# EAGLE design psRevB (EAGLE 7.4.0)
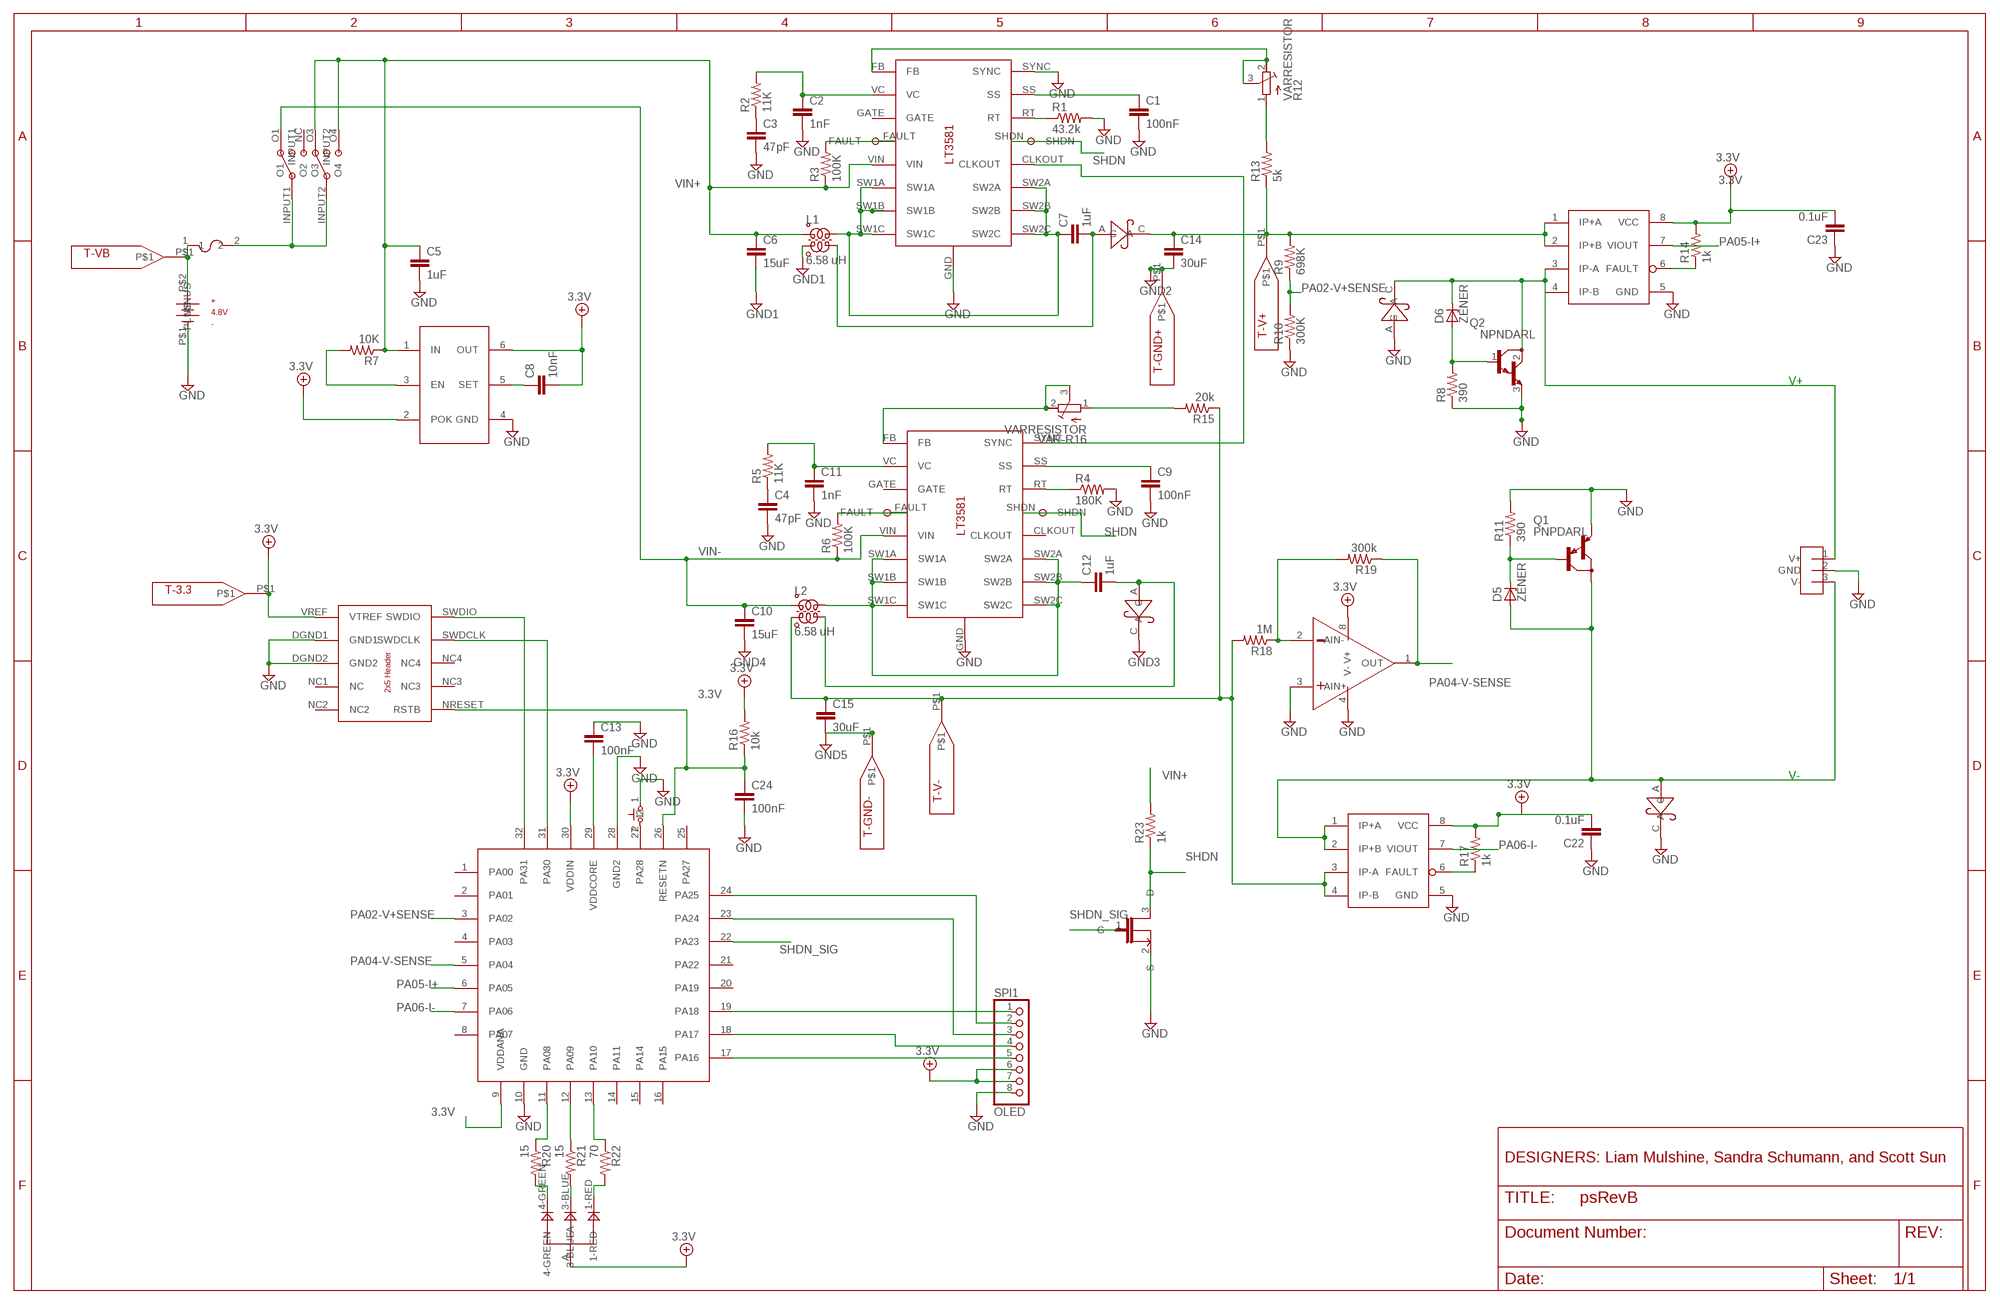
[diagram p0: schematic, sheet 1]

## Parts
BT1  BATTERY  [POWERHEAD]
C1  100nF  C-EUC0603K  [C0603K]
C2  1nF  C-EUC0603K  [C0603K]
C3  47pF  C-EUC0603K  [C0603K]
C4  47pF  C-EUC0805  [C0805]
C5  1uF  C-EUC0805  [C0805]
C6  15uF  C-EUC0805  [C0805]
C7  1uF  C-EUC0805  [C0805]
C8  10nF  C-EUC0805  [C0805]
C9  100nF  C-EUC0805  [C0805]
C10  15uF  C-EUC0805  [C0805]
C11  1nF  C-EUC0805  [C0805]
C12  1uF  C-EUC0805  [C0805]
C13  100nF  C-EUC0805  [C0805]
C14  30uF  C-EUC1206K  [C1206K]
C15  30uF  C-EUC1206K  [C1206K]
C22  0.1uF  C-EUC0805  [C0805]
C23  0.1uF  C-EUC0805  [C0805]
C24  100nF  C-EUC0805  [C0805]
D1  SCHTKYDIODE  [SCHTKYDIODE]
D2  SCHTKYDIODE  [SCHTKYDIODE]
D3  SCHTKYDIODE  [SCHTKYDIODE]
D4  SCHTKYDIODE  [SCHTKYDIODE]
D5  ZENER  [ZENER]
D6  ZENER  [ZENER]
DBG1  DEBUGHEAD  [DEBUGHEAD]
F1  FUSE  [FUSE]
L1  6.58 uH  ZD60820510  [COUPLED_INDUCTOR@1]
L2  6.58 uH  COUPLED_INDUCTOR  [COUPLED_INDUCTOR]
Q1  PNPDARL  [DPAKTO252]
Q2  NPNDARL  [DPAKTO252]
R1  43.2k  R-US_R0603  [R0603]
R2  11K  R-US_R0603  [R0603]
R3  100K  R-US_R0603  [R0603]
R4  180K  R-US_R0603  [R0603]
R5  11K  R-US_R0603  [R0603]
R6  100K  R-US_R0603  [R0603]
R7  10K  R-US_R0603  [R0603]
R8  390  R-US_R0603  [R0603]
R9  698K  R-US_R0603  [R0603]
R10  300K  R-US_R0603  [R0603]
R11  390  R-US_R0603  [R0603]
R12  VARRESISTOR  [1X03]
R13  5k  R-US_R0603  [R0603]
R14  1k  R-US_R0603  [R0603]
R15  20k  R-US_R0603  [R0603]
R16  10k  R-US_R0603  [R0603]
R17  1k  R-US_R0603  [R0603]
R18  1M  R-US_R0603  [R0603]
R19  300k  R-US_R0603  [R0603]
R20  15  R-US_R0603  [R0603]
R21  15  R-US_R0603  [R0603]
R22  70  R-US_R0603  [R0603]
R23  1k  R-US_R0603  [R0603]
S1  DPDT  [SWITCHHEAD]
S2  PUSHBTN  [1X02]
SPI1  OLED  PINHD-1X8  [1X08]
T-3.3  TEST_POINT  [TEST_POINT]
T-GND+  TEST_POINT  [TEST_POINT]
T-GND-  TEST_POINT  [TEST_POINT]
T-V+  TEST_POINT  [TEST_POINT]
T-V-  TEST_POINT  [TEST_POINT]
T-VB  TEST_POINT  [TEST_POINT]
U1  LT3581  [LT3581]
U2  SAMD21E  [TQFP32-08]
U3  AS1363  [SOT23-6]
U4  VOUT  [1X03]
U5  ACS711  [SOIC8]
U6  ACS711  [SOIC8]
U7  LT3581  [LT3581]
U8  RGBLED  [RGBLED]
U9  LMC6482  [SOIC8]
U$1  NMOS  [SOT23-3]
VAR-R16  VARRESISTOR  [1X03]

## Nets
3.3V: C8.2 C22.2 C23.2 DBG1.VREF(VTREF) R14.2 R16.2 R17.2 SPI1.6(VIN1) SPI1.7(VIN2) T-3.3.P$1 U2.9(VDDANA) U2.30(VDDIN) U3.2(POK) U3.6(OUT) U5.8(VCC) U6.8(VCC) U8.A U9.8(V+)
GND: BT1.P$1(MINUS) C1.2 C2.2 C3.2 C4.2 C5.2 C6.2 C9.2 C10.2 C11.2 C13.1 C14.2 C15.2 C22.1 C23.1 C24.2 D1.C D2.C D3.A DBG1.DGND1(GND1) DBG1.DGND2(GND2) L1.L2A Q1.3(E) Q2.3(E) R1.2 R4.2 R8.1 R10.1 R11.2 S2.1 SPI1.8(GND) T-GND+.P$1 T-GND-.P$1 U1.GND U1.SYNC U2.10(GND) U2.28(GND2) U3.4(GND) U4.2(GND) U5.5(GND) U6.5(GND) U7.GND U9.3(AIN+) U9.4(V-) U$1.2(S) ; supply symbol labelled GND1, GND4, GND2, GND3, GND5
N$1: R1.1 U1.RT
N$2: C1.1 U1.SS
N$3: C3.1 R2.1
N$4: C2.1 R2.2 U1.VC
N$5: R4.1 U7.RT
N$6: C9.1 U7.SS
N$7: C4.1 R5.1
N$8: C11.1 R5.2 U7.VC
N$9: S2.2 U2.27(PA28)
N$10: D3.C D6.C Q2.2(C) U4.1(V+) U5.3(IP-A) U5.4(IP-B)
N$11: C12.2 D1.A L2.L2B
N$12: R17.1 U6.6(FAULT)
N$13: C8.1 U3.5(SET)
N$14: U7.FB VAR-R16.2(PLUS) VAR-R16.3(WIPER)
N$15: R12.2(PLUS) R12.3(WIPER) U1.FB
N$16: R7.2 U3.3(EN)
N$17: C24.1 DBG1.NRESET(RSTB) R16.1 U2.26(RESETN)
N$18: D6.A Q2.1(B) R8.2
N$19: BT1.P$2(PLUS) F1.1 T-VB.P$1
N$20: C7.1 L1.L1B U1.SW1A U1.SW1B U1.SW1C U1.SW2A U1.SW2B U1.SW2C
N$21: C12.1 L2.L1B U7.SW1A U7.SW1B U7.SW1C U7.SW2A U7.SW2B U7.SW2C
N$22: R15.2 VAR-R16.1(MINUS)
N$23: C7.2 D4.A L1.L2B
N$24: D5.C Q1.1(B) R11.1
N$25: C15.1 L2.L2A R15.1 R18.2 T-V-.P$1 U6.3(IP-A) U6.4(IP-B)
N$26: C14.1 D4.C R9.2 R13.1 T-V+.P$1 U5.1(IP+A) U5.2(IP+B)
N$27: R12.1(MINUS) R13.2
N$28: R18.1 R19.2 U9.2(AIN-)
N$30: R14.1 U5.6(FAULT)
N$31: R20.2 U8.4-GREEN
N$32: R21.2 U8.3-BLUE
N$33: R22.2 U8.1-RED
N$34: D2.A D5.A Q1.2(C) U4.3(V-) U6.1(IP+A) U6.2(IP+B)
N$35: R20.1 U2.11(PA08)
N$36: R21.1 U2.12(PA09)
N$37: R22.1 U2.13(PA10)
N$43: C13.2 U2.29(VDDCORE)
N$44: DBG1.SWDIO U2.32(PA31)
N$45: DBG1.SWDCLK U2.31(PA30)
N$46: SPI1.1(CS) U2.19(PA18)
N$47: SPI1.2(RST) U2.24(PA25)
N$48: SPI1.3(D/C) U2.23(PA24)
N$49: SPI1.5(DATA) U2.17(PA16)
N$51: SPI1.4(CLK) U2.18(PA17)
N$53: F1.2 S1.INPUT1 S1.INPUT2
PA02-V+SENSE: R9.1 R10.2 U2.3(PA02)
PA04-V-SENSE: R19.1 U2.5(PA04) U9.1(OUT)
PA05-I+: U2.6(PA05) U5.7(VIOUT)
PA06-I-: U2.7(PA06) U6.7(VIOUT)
PA11-FAULT1: R3.2 U1.FAULT
PA19-FAULT2: R6.2 U7.FAULT
SHDN: R23.1 U1.SHDN U7.SHDN U$1.3(D)
SHDN_SIG: U2.22(PA23) U$1.1(G)
SYNC: U1.CLKOUT U7.SYNC
VIN+: C5.1 C6.1 L1.L1A R3.1 R7.1 R23.2 S1.O3 S1.O4 U1.VIN U3.1(IN)
VIN-: C10.1 L2.L1A R6.1 S1.O1 U7.VIN
Unconnected: DBG1.NC1(NC) DBG1.NC2 DBG1.NC3 DBG1.NC4 S1.NC(O2) U1.GATE U2.1(PA00) U2.2(PA01) U2.4(PA03) U2.8(PA07) U2.14(PA11) U2.15(PA14) U2.16(PA15) U2.20(PA19) U2.21(PA22) U2.25(PA27) U7.CLKOUT U7.GATE U9.5(AIN+) U9.6(AIN-) U9.7(OUT)

## Notes on the sheet
- V+
- V-
- DESIGNERS: Liam Mulshine, Sandra Schumann, and Scott Sun

## Library data of the parts
BT1 = ps-custom:BATTERY
C1-C13 C22-C24 = resistor:C-EU: CAPACITOR, European symbol
C14 C15 = foe-scale:C-EU: CAPACITOR, European symbol
D1-D4 = ps-custom:SCHTKYDIODE: Schottky Diode
D5 D6 = ps-custom:ZENER
DBG1 = foe-scale:DEBUGHEAD
F1 = ps-custom:FUSE
L1 = ps-custom:ZD60820510: Coiltronics DRQ Series Dual winding, shielded inductors/transformers
L2 = ps-custom:COUPLED_INDUCTOR: Coiltronics DRQ Series Dual winding, shielded inductors/transformers
Q1 = ps-custom:PNPDARL: PNP Darlington Transistor
Q2 = foe-scale:NPNDARL
R1-R11 R13-R23 = resistor:R-US_: RESISTOR, American symbol
R12 VAR-R16 = ps-custom:VARRESISTOR
S1 = ps-custom:DPDT
S2 = ps-custom:PUSHBTN: Short pins 1 and 2 together... Short pins 3 and 4 together...
SPI1 = ps-custom:PINHD-1X8: PIN HEADER
T-3.3 T-GND+ T-GND- T-V+ T-V- T-VB = ps-custom:TEST_POINT
U1 U7 = foe-scale:LT3581
U2 = ps-custom:SAMD21E
U3 = ps-custom:AS1363
U4 = ps-custom:VOUT
U5 U6 = ps-custom:ACS711
U8 = ps-custom:RGBLED
U9 = ps-custom:LMC6482
U$1 = foe-scale:NMOS

## Board
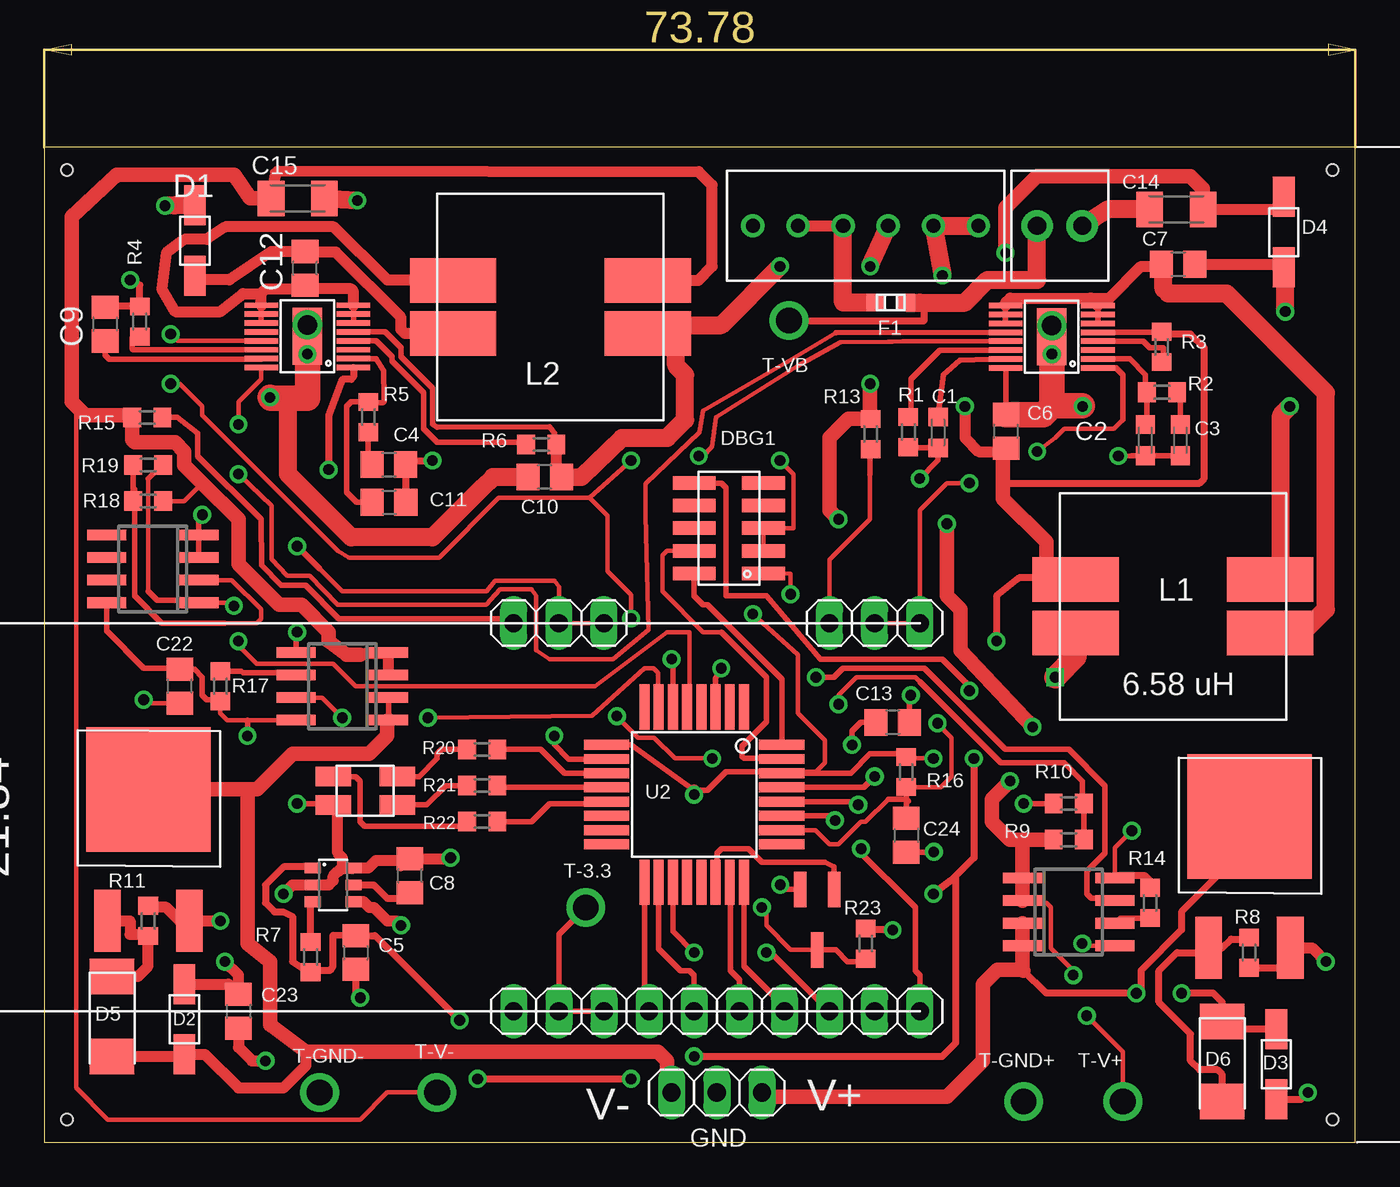
[diagram p1: board, top side]
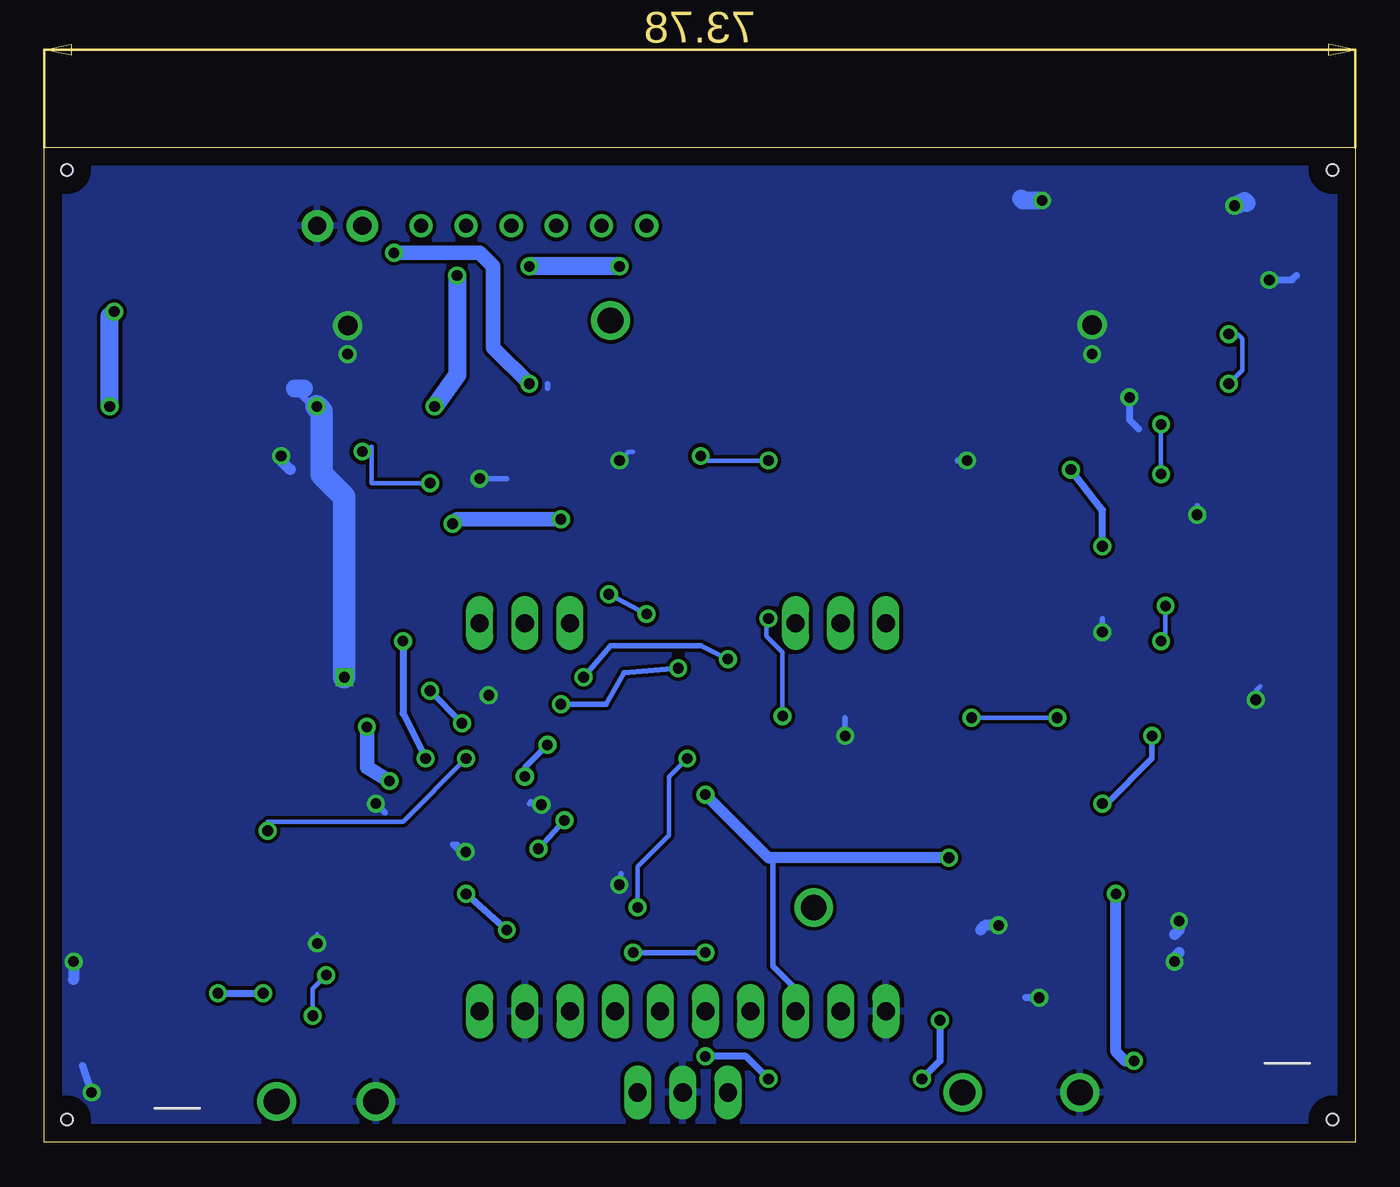
[diagram p2: board, bottom side, seen from below]

Size 73.78 x 55.98 mm. Coordinates in mm from the lower left corner, seen from the top.
Outline: 0,0 73.78,0 73.78,55.98 0,55.98 0,0
Copper layers (1*16): Top 0.035mm / dielectric 1.5mm / Bottom 0.035mm
Design rules "default": minimum track width 10mil, minimum drill 24mil, track to track 8mil, track to pad 8mil, pad to pad 8mil, via to via 8mil, smd to smd 8mil, copper to edge 40mil, drill to drill 8mil, minimum pad ring 10mil, minimum via ring 8mil, stop-mask expansion 4mil, vias tented up to drill 0mil, thermal gap 10mil
Holes 0.65 mm at 1.27,1.27 1.27,54.71 72.51,54.71 72.51,1.27

### Footprints (pad centres in the part's own frame; a part is rotated, then mirrored left to right if it is on the bottom)
POWERHEAD = drill 1.016 pad 1.778: P$1 -1.27,0; P$2 1.27,0
C0603K = smd 1.05 x 1.08: 1 -0.875,0; 2 0.875,0
C0805 = smd 1.3 x 1.5: 1 -0.95,0; 2 0.95,0
C1206K = smd 1.5 x 2: 1 -1.5,0; 2 1.5,0
SCHTKYDIODE = smd 2.25 x 1.22: A 3.95,0; C 0,0
ZENER = smd 2 x 2.5: A -0.25,0; C 4.25,0
DEBUGHEAD = smd 0.76 x 2.4: DGND1 1.27,-3.9; DGND2 2.54,-3.9; NC1 3.81,-3.9; NC2 5.08,-3.9; NC3 3.81,0; NC4 2.54,0; NRESET 5.08,0; SWDCLK 1.27,0; SWDIO 0,0; VREF 0,-3.9
FUSE = smd 1 x 1: 1 0,0; 2 1.74,0
COUPLED_INDUCTOR@1 = smd 4.85 x 2.5: L1A 0,3; L1B 10.95,0; L2A 0,0; L2B 10.95,3
COUPLED_INDUCTOR = smd 4.85 x 2.5: L1A 0,3; L1B 10.95,0; L2A 0,0; L2B 10.95,3
DPAKTO252 = smd 1.5 x 3.5: 1 0,-0.5; 3 4.6,-0.5 | smd 7 x 7: 2 2.3,6.9
R0603 = smd 1 x 1.1: 1 -0.85,0; 2 0.85,0
1X03 = drill 1.016 long: 1 -2.54,0; 2 0,0; 3 2.54,0
SWITCHHEAD = drill 0.8: INPUT1 1.27,0; INPUT2 3.81,0; NC 6.35,0; O1 -1.27,0; O3 -6.35,0; O4 -3.81,0
1X02 = drill 1.016 long: 1 -1.27,0; 2 1.27,0
1X08 = drill 1.016 long: 1 -8.89,0; 2 -6.35,0; 3 -3.81,0; 4 -1.27,0; 5 1.27,0; 6 3.81,0; 7 6.35,0; 8 8.89,0
TEST_POINT = drill 1.448: P$1 0,0
LT3581 = smd 0.305 x 1.889: CLKOUT 2.002,4.691; FAULT 1.501,-0.5; FB 0,-0.5; GATE 1.001,-0.5; RT 1.001,4.691; SHDN 1.501,4.691; SS 0.5,4.691; SW1A 2.502,-0.5; SW1B 3.002,-0.5; SW1C 3.503,-0.5; SW2A 2.502,4.691; SW2B 3.002,4.691; SW2C 3.503,4.691; SYNC 0,4.691; VC 0.5,-0.5; VIN 2.002,-0.5 | smd 3.2 x 1.651: GND 1.751,2.095
TQFP32-08 = smd 2.54 x 0.559: 1 -4.928,2.8; 2 -4.928,2; 3 -4.928,1.2; 4 -4.928,0.4; 5 -4.928,-0.4; 6 -4.928,-1.2; 7 -4.928,-2; 8 -4.928,-2.8; 17 4.928,-2.8; 18 4.928,-2; 19 4.928,-1.2; 20 4.928,-0.4; 21 4.928,0.4; 22 4.928,1.2; 23 4.928,2; 24 4.928,2.8 | smd 0.559 x 2.54: 9 -2.8,-4.928; 10 -2,-4.928; 11 -1.2,-4.928; 12 -0.4,-4.928; 13 0.4,-4.928; 14 1.2,-4.928; 15 2,-4.928; 16 2.8,-4.928; 25 2.8,4.928; 26 2,4.928; 27 1.2,4.928; 28 0.4,4.928; 29 -0.4,4.928; 30 -1.2,4.928; 31 -2,4.928; 32 -2.8,4.928
SOT23-6 = smd 0.6 x 0.9: 1 -0.95,-1.15; 2 0,-1.15; 3 0.95,-1.15; 4 0.95,1.15; 5 0,1.15; 6 -0.95,1.15
SOIC8 = smd 0.6 x 2.2: 1 -1.905,-2.6; 2 -0.635,-2.6; 3 0.635,-2.6; 4 1.905,-2.6; 5 1.905,2.6; 6 0.635,2.6; 7 -0.635,2.6; 8 -1.905,2.6
RGBLED = smd 2 x 1.1: 1-RED 0,0; 3-BLUE 3.6,-1.6; 4-GREEN 3.6,0; A 0,-1.6
SOT23-3 = smd 0.7 x 2: 1 0,0; 2 1.9,0; 3 0.95,3.4

### Placement (x,y rotation side)
BT1  57.15,51.56 180 top
C1  50.31,39.93 270 top
C2  61.97,39.5 270 top
C3  63.94,39.5 270 top
C4  19.39,38.13 0 top
C5  17.53,10.67 270 top
C6  54.13,39.99 90 top
C7  63.82,49.4 0 top
C8  20.57,14.99 90 top
C9  3.43,46.03 90 top
C10  28.16,37.43 180 top
C11  19.4,36.01 0 top
C12  14.67,49.16 90 top
C13  47.75,23.62 180 top
C14  63.71,52.48 180 top
C15  14.26,53.11 0 top
C22  7.62,25.65 90 top
C23  10.92,7.37 270 top
C24  48.51,17.27 270 top
D1  8.47,52.71 270 top
D2  7.87,8.89 270 top
D3  69.34,6.35 270 top
D4  69.77,53.19 270 top
D5  3.81,5.08 90 top
D6  66.29,2.54 90 top
DBG1  36.58,32 90 top
F1  48.51,47.24 180 top
L1  58.05,28.65 0 top
L2  33.96,48.49 180 top
Q1  3.56,12.95 0 top
Q2  65.53,11.43 0 top
R1  48.63,39.95 270 top
R2  62.91,42.19 180 top
R3  62.89,44.75 270 top
R4  5.37,46.17 90 top
R5  18.23,40.8 90 top
R6  27.96,39.25 180 top
R7  14.99,10.41 90 top
R8  67.82,10.67 90 top
R9  57.66,17.02 180 top
R10  57.66,19.05 0 top
R11  5.84,12.45 90 top
R12  46.74,29.21 0 top
R13  46.5,39.84 270 top
R14  62.23,13.46 90 top
R15  5.79,40.78 0 top
R16  48.51,20.83 90 top
R17  9.91,25.65 270 top
R18  5.84,36.07 0 top
R19  5.84,38.1 180 top
R20  24.64,22.1 180 top
R21  24.64,20.07 180 top
R22  24.64,18.03 180 top
R23  46.23,11.18 90 top
S1  46.23,51.56 180 top
S2  48.01,7.37 0 top
SPI1  35.31,7.37 180 top
T-3.3  30.48,13.21 0 top
T-GND+  55.12,2.29 0 top
T-GND-  15.49,2.79 0 top
T-V+  60.71,2.29 0 top
T-V-  22.1,2.79 0 top
T-VB  41.91,46.23 0 top
U1  58.8,43.57 90 top
U2  36.58,19.56 270 top
U3  16.26,14.48 270 top
U4  37.85,2.79 180 top
U5  57.66,12.95 270 top
U6  16.76,25.65 90 top
U7  16.9,43.59 90 top
U8  16.26,20.57 0 top
U9  6.1,32.26 90 top
U$1  44.45,14.22 180 top
VAR-R16  28.96,29.21 0 top

### Tracks (layer width: path | path; a pad name or v marks a point on that pad's centre or on a via)
3.3V  (via drill 0.6, 0.6 pad 1.02)
  Top 0.254: U6.8 11.43,23.75 10.29,23.75 9.91,24.13 R17.2 | U5.8 60.26,16.57 v61.21,17.53 | v50.04,21.59 48.6,21.59 R16.2 | 41.43,20.83 43.43,20.83 43.94,21.34 43.94,22.61 42.42,24.13 42.42,27.43 v39.88,29.72 | v42,30.82 41.99,32 DBG1.VREF
  Top 0.305: U2.9 33.02,22.35 36.58,19.81 37.34,19.81 38.35,20.83 41.43,20.83 U2.30 45.4,20.76 46.48,21.84 48.35,21.84 R16.2 | R17.2 9.82,24.89 9.14,24.89 8.89,25.15 8.89,26.16 8.45,26.6 C22.2 7.55,26.67 5.59,26.67 3.5,28.76 U9.8 | v14.22,19.05 16.18,19.05 U8.A | SPI1.6 SPI1.7 28.96,11.68 T-3.3.P$1 | v11.43,22.86 11.43,23.75
  Top 0.406: 20.07,15.43 C8.2 | 17.34,15.49 U3.6 | R14.2 62.23,14.73 61.98,14.99 60.38,14.99 U5.8
  Top 0.61: 16.78,15.43 16.71,15.35 16.65,15.35 16.54,15.24 16.51,15.24 16.26,14.99 16.26,14.73 16,14.48 U3.2 13.97,14.48 v13.46,13.97 | 16.78,15.43 U3.6 18.24,15.43 18.67,15.86 20.5,15.86 C8.2 22.79,15.94 v22.86,16 | 16.78,15.43 16.78,15.99 16.51,16.26 16.51,18.72 U8.A | v36.58,19.56 36.58,19.81 | C23.2 10.92,5.33 11.68,4.57 v12.45,4.57
  Bottom 0.254: v61.21,17.53 61.21,18.03 53.59,18.03 v50.04,21.59 | v39.88,29.72 v42,30.82
  Bottom 0.305: v14.22,19.05 13.97,19.05 11.43,21.59 v11.43,22.86 | SPI1.6 31.5,8.64 32.77,9.91 32.77,16
  Bottom 0.61: v22.86,16 32.77,16 33.02,16 v36.58,19.56 | v12.45,4.57 12.95,4.57 13.46,5.08 v13.46,13.97
GND  (via drill 0.6, 0.6 pad 0.81, 0.6 pad 1.02, 1.1 pad 1.42)
  Top 0.254: v14.8,44.34 15.24,45.72 | C22.1 5.78,24.7 v5.59,24.89 | DBG1.DGND1 DBG1.DGND2 42.16,34.54 42.16,37.59 v41.4,38.35 | U5.5 58.55,11.05 v58.42,11.18
  Top 0.305: C3.2 C2.2 61.2,38.62 v60.45,38.61 | C6.2 54.13,43.54 U1.SYNC | R1.2 48.67,39.06 C1.2 50.31,38.37 v49.28,37.34 | C11.2 C4.2 | U6.5 14.16,28.64 v14.22,28.7 | U9.3 U9.4 8.7,35.11 v8.89,35.31 | U2.28 45.69,19.16 v45.81,18.98 | C24.2 50.05,16.32 v50.06,16.33 | C13.1 48.7,25.08 v48.77,25.15 | R10.1 v55.12,19.05 | U$1.2 41.66,14.22 v41.42,14.48 | U2.10 29.5,21.56 28.7,22.35 v28.7,22.86
  Top 0.406: C5.2 17.53,8.38 v17.78,8.13 | C9.2 3.72,47.02 R4.2 5.37,48.23 v4.83,48.51 | C11.2 20.35,38.33 20.32,38.35 v21.84,38.35 | R8.1 70.02,9.82 70.1,9.91 70.1,10.9 Q2.3 | D3.A 70.73,2.4 v71.12,2.79
  Top 0.61: U3.4 17.97,13.53 18.29,13.21 18.54,13.21 19.3,12.45 19.81,12.45 v20.07,12.19 | Q2.3 71.37,10.93 v72.14,10.16 | R11.2 5.93,13.21 6.86,13.21 7.61,12.45 Q1.3 v9.9,12.45 v9.91,12.45 | D2.C 10.35,8.89 C23.1 10.92,9.4 v10.16,10.16
  Top 1.016: C15.2 17.61,52.99 v17.62,52.98 | D1.C 7.31,52.7 v6.79,52.69 | C14.2 59.85,52.48 BT1.P$1 | 13.97,41.87 13.72,41.61 13.72,37.59 17.27,34.04 21.84,34.04 24.64,36.83 25.25,37.42 25.44,37.44 27.16,37.44 C10.2
  Top 1.27: L1.L2A 58.05,27.31 v56.9,26.16
  Top 1.422: U7.GND 14.81,41.87 13.97,41.87 12.74,41.87 v12.7,41.91 | v56.71,44.34 56.71,41.43 56.71,41.42 | 56.71,41.42 58.42,41.42 | C6.2 56.22,40.94 56.71,41.42 | v56.71,45.94 U1.GND
  Bottom 0.254: v5.59,24.89 5.59,25.4 5.33,25.65 | v41.4,38.35 40.89,38.86 40.64,38.86 | v58.42,11.18 58.42,11.68
  Bottom 0.305: v49.28,37.34 47.75,37.34 | v14.22,28.7 14.22,29.46 | v8.89,35.31 8.89,35.81 | v45.81,18.98 46.39,19.14 46.41,19.13 46.41,19.12 46.48,19.05 | v50.06,16.33 50.37,16.33 50.8,16.76 50.55,16.76 | v48.77,25.15 49.02,25.15 | 45.47,42.42 45.47,42.67 | v55.12,19.05 54.61,18.54 | v41.42,14.48 41.32,15.11 | v28.7,22.86 28.7,23.88
  Bottom 0.406: v17.78,8.13 18.54,8.13 | v4.83,48.51 3.56,48.51 3.3,48.77 | v21.84,38.35 22.35,38.35 | v12.7,41.91 12.7,40.64 12.19,40.13 | v71.12,2.79 71.63,4.32 | v58.45,41.4 58.42,41.4 58.67,41.4 59.69,42.42
  Bottom 0.61: v60.45,38.61 60.45,38.35 59.94,37.85 | v20.07,12.19 20.83,12.19 21.08,11.94 | v72.14,10.16 72.14,9.14 | v9.91,12.45 9.91,11.94 10.16,11.68 | v10.16,10.16 10.16,10.41 9.91,10.67
  Bottom 1.016: v17.62,52.98 18.69,52.98 18.8,53.09 | v6.79,52.69 6.21,52.95 6.1,52.83 | 59.69,42.42 59.18,42.42
  Bottom 1.27: v56.9,26.16 56.9,36.32 58.17,37.59 58.17,41.12 v58.45,41.4
  other vias: 14.8,45.99
  pour Bottom: 0,-0.25 73.41,0 73.91,55.88 0,55.88
N$1
  Top 0.305: U1.RT 50.41,44.57 48.77,42.93 48.77,40.94 R1.1
N$2
  Top 0.305: U1.SS 51.54,44 50.59,43.17 C1.1
N$3
  Top 0.305: C3.1 63.94,42.01 R2.1
N$4
  Top 0.305: U1.VC 61.09,44.07 61.98,43.18 61.98,42.28 R2.2 62.06,40.46 C2.1
N$5
  Top 0.305: U7.RT 4.99,44.59 4.93,44.65 4.93,45.25 R4.1
N$6
  Top 0.305: C9.1 3.42,44.28 3.64,44.07 12.19,44.07 U7.SS
N$7
  Top 0.305: R5.1 18.23,38.34 C4.1
N$8
  Top 0.305: U7.VC 18.69,44.09 19.11,43.4 19.11,42.82 19.11,42.47 19.11,41.7 19.03,41.62 18.26,41.62 R5.2 18.22,41.66 17.27,41.66 17.02,41.4 17.02,36.58 17.59,36.01 C11.1
N$9  (via drill 0.6 pad 1.02)
  Top 0.305: U2.27 44.13,18.36 v44.51,18.1 | v45.97,16.51 45.72,16.51 49.02,13.21 49.02,9.65 49.28,9.4 S2.2
  Bottom 0.305: v44.51,18.1 v45.97,16.51
N$10  (via drill 0.6)
  Top 0.406: D3.C 66.73,6.35 D6.C 66.29,7.87 65.79,8.38 v64.01,8.38 | 55.12,9.65 56.39,8.38 v61.47,8.38 61.72,8.64 61.72,9.65 64.01,11.94 64.01,12.95 67.83,16.78 Q2.2
  Top 0.813: U5.3 U5.4 55.06,9.71 | 55.06,9.71 55.12,9.65 | 55.06,9.71 53.65,9.71 52.83,8.89 52.83,4.57 50.8,2.54 40.64,2.54 U4.1
  Bottom 0.406: v64.01,8.38 v61.47,8.38
N$11
  Top 0.61: 8.68,49.22 D1.A 8.97,48.51 10.41,48.51 12.78,50.11 C12.2 14.7,50.08 16.4,50.08 20.07,46.41 20.07,45.72 20.3,45.49 L2.L2B
N$12
  Top 0.305: R17.1 11.09,26.5 11.18,26.42 14.04,26.42 U6.6
N$13
  Top 0.406: U3.5 18.54,14.48 19.3,13.72 20.51,13.72 C8.1
N$14  (via drill 0.6, 0.6 pad 1.02)
  Top 0.254: 15.49,32.26 16.76,30.99 24.89,30.99 25.38,31.59 28.71,31.59 28.96,31.24 VAR-R16.2 VAR-R16.3
  Top 0.305: v14.22,33.53 15.49,32.26
  Top 0.406: U7.FB 17.4,43.06 17.27,42.93 16.76,42.93 16,40.89 v16,37.85
  Bottom 0.406: v14.22,33.53 14.22,35.56 v16,37.85
N$15  (via drill 0.6)
  Top 0.254: v52.07,37.08 50.8,37.08 49.28,35.56 R12.3 R12.2 | v55.88,38.86 56.9,39.62 57.4,40.13 60.2,40.13 60.71,40.64
  Top 0.305: U1.FB 60.32,43.57 60.71,43.18 60.71,40.64
  Bottom 0.254: v52.07,37.08 55.37,37.08 55.37,39.12 v55.88,38.86
N$16
  Top 0.406: R7.2 14.99,13.41 U3.3
N$17  (via drill 0.6)
  Top 0.254: v50.27,23.57 51.06,22.76 51.05,20.57 50.46,19.98 R16.1 | U2.26 43.4,17.56 44.2,16.76 44.7,16.76 45.97,18.03 46.23,18.03 47.5,19.3
  Top 0.305: C24.1 48.51,19.3 | 48.51,19.3 R16.1 | 47.5,19.3 48.51,19.3 | 48.64,19.18 48.51,19.3 | v52.07,25.4 52.07,25.65 50.55,27.18 43.69,27.18 40.64,30.73 38.35,30.73 38.35,36.83 38.1,37.08 DBG1.NRESET
  Bottom 0.305: v50.27,23.57 v52.07,25.4
N$18
  Top 0.406: R8.2 67.73,11.43 66.8,11.43 66.3,10.93 Q2.1 65.27,10.67 63.75,10.67 62.74,9.65 62.74,7.87 64.52,6.1 64.52,4.57 65.02,4.06 66.04,4.06 66.29,3.81 D6.A
N$19
  Top 0.406: T-VB.P$1 49.53,46.23 49.53,46.99 49.28,47.24
  Top 1.016: F1.1 49.28,47.24 51.82,47.24 53.09,48.51 55.88,48.51 BT1.P$2
N$20
  Top 0.305: U1.SW1A U1.SW1B U1.SW1C | U1.SW2A U1.SW2B U1.SW2C
  Top 0.61: U1.SW2C 54.11,47.25 54.36,47.5 58.87,47.5 U1.SW1C 59.3,47.13 58.93,47.5 59.94,47.5 61.72,49.28 62.74,49.28 C7.1
  Top 0.813: 63.25,47.75 62.99,48.01 | 62.99,49.27 C7.1
  Top 1.016: 63.25,47.75 66.55,47.75 72.14,42.16 72.14,29.97 70.81,28.65 L1.L1B | 62.99,48.01 62.99,49.27
N$21
  Top 0.305: U7.SW2A U7.SW2B U7.SW2C | U7.SW1C U7.SW1B U7.SW1A
  Top 0.61: U7.SW2C 12.21,47.77 | 12.21,47.77 12.45,48.01 14.46,48.01 C12.1 14.88,48.01 17.27,48.01 17.4,47.88 U7.SW1C | 12.21,47.77 12.19,47.75 11.18,47.75 9.91,46.74 7.37,46.74 6.6,48.01 6.86,50.04 7.87,50.8 9.14,50.8 10.19,51.5 16.28,51.5 19.3,48.51 22.99,48.51 L2.L1B
N$22
  Top 0.305: R15.2 7.48,40.78 8.64,39.88 8.64,38.61 12.19,35.05 12.23,32.46 13.34,31.33 14.69,31.34 16.55,29.46 26.16,29.46 VAR-R16.1
N$23  (via drill 0.6)
  Top 0.61: C7.2 69.6,49.4 D4.A
  Top 1.016: v69.85,46.74 69.85,49.15 D4.A | L1.L2B 69.24,31.65 69.6,32 69.6,40.89 v70.1,41.4
  Bottom 1.016: v70.1,41.4 70.1,46.48 v69.85,46.74
N$24
  Top 0.61: Q1.1 4.56,12.45 4.83,12.45 4.83,11.68 5.75,11.68 R11.1 5.84,9.91 5.27,9.33 D5.C
N$25
  Top 0.254: R18.2 7.87,36.07 8.89,37.08 | T-V-.P$1 19.3,2.79 17.78,1.27 3.56,1.27 1.78,3.05 1.78,40.89 2.03,41.15
  Top 0.305: 12.84,54.61 13.02,54.42
  Top 0.61: C15.1 13.02,54.42 13.14,54.65 36.83,54.61 37.59,53.85 37.59,49.28 36.81,48.49 L2.L2A | 17.78,27.43 18.04,27.43 18.13,27.52 19.33,27.52 U6.4 U6.3
  Top 0.813: C15.1 11.58,53.1 10.67,54.44 4.06,54.44 1.52,52.07 1.52,41.66 2.03,41.15 2.29,40.89 4.82,40.89 R15.1 4.94,39.51 5.08,39.37 7.37,39.37 7.87,38.86 7.87,38.1 8.89,37.08 10.92,35.05 10.92,32.51 13.21,30.23 14.48,30.23 16,28.7 16,28.19 17.02,27.43 17.78,27.43
N$26  (via drill 0.6)
  Top 0.254: T-V+.P$1 60.71,5.08 v58.67,7.11 | v57.91,9.4 57.91,9.65 56.64,10.92 56.64,13.21 56.39,13.46 55.18,13.46 U5.2
  Top 0.406: U5.2 U5.1
  Top 0.61: C14.1 69.71,52.48 D4.C
  Top 0.813: C14.1 65.22,53.66 64.52,54.36 55.88,54.36 54.1,52.58 v54.1,50.04 | v46.48,42.67 46.48,40.72 R13.1 45.27,40.7 44.2,39.62 44.2,35.56 v44.7,35.05 | v50.8,34.8 50.8,30.73 51.56,29.97 51.56,27.69 v55.63,23.37 | v54.36,20.32 53.34,19.3 53.34,18.03 54.36,17.02 55.12,17.02 | 55.12,17.02 R9.2 | U5.1 55.06,16.96 55.12,17.02 | U5.2 55.06,14.67 55.12,14.73
  Bottom 0.254: v58.67,7.11 58.67,8.64 v57.91,9.4
  Bottom 0.813: v54.1,50.04 49.28,50.04 48.51,49.28 48.51,44.7 v46.48,42.67 | v44.7,35.05 50.55,35.05 v50.8,34.8 | v55.63,23.37 55.63,21.08 v54.36,20.32
N$27
  Top 0.254: 46.48,37.59 46.48,35.05 44.2,32.77 R12.1
  Top 0.305: 46.48,37.59 46.48,38.97 R13.2
N$28
  Top 0.254: U9.2 10.54,31.62 12.19,29.97 12.19,29.46 11.94,29.21 9.65,29.21
  Top 0.305: R19.2 R18.1 5.08,36.74 5.08,30.73 6.6,29.21 9.65,29.21 10.16,29.21
N$30
  Top 0.305: R14.1 60.55,12.61 U5.6
N$31
  Top 0.305: U8.4-GREEN 21.08,20.57 22.1,21.59 22.1,21.84 22.35,22.1 R20.2
N$32
  Top 0.305: U8.3-BLUE 21.51,18.97 22.61,20.07 R21.2
N$33
  Top 0.305: U8.1-RED 17.53,20.57 17.78,20.32 17.78,18.03 18.03,17.78 23.53,17.78 R22.2
N$34
  Top 0.305: U6.1 U6.2
  Top 0.61: D5.A 7.76,4.83 D2.A 9.03,4.94 10.92,3.05 13.46,3.05 14.73,4.32 14.73,5.08
  Top 0.813: Q1.2 11.98,19.85 | 11.98,19.85 13.97,21.84 18.29,21.84 19.3,22.86 19.3,23.69 U6.1 | 11.98,19.85 11.43,19.81 11.43,11.18 12.7,10.16 12.7,6.6 14.73,5.08 34.54,5.08 35.05,4.57 35.05,3.05 U4.3
N$35
  Top 0.305: U2.11 29.28,20.76 27.94,22.1 R20.1
N$36
  Top 0.305: U2.12 25.6,19.96 R21.1
N$37
  Top 0.305: R22.1 27.43,18.03 28.45,19.05 31.54,19.05 U2.13
N$43  (via drill 0.6 pad 1.02)
  Top 0.305: U2.29 46.12,19.96 v46.74,20.57 | v45.47,22.35 45.47,23.11 45.97,23.62 C13.2
  Bottom 0.305: v46.74,20.57 46.74,21.08 v45.47,22.35
N$44
  Top 0.254: DBG1.SWDIO 36.58,31.75
  Top 0.305: U2.32 41.5,26.06 37.34,30.23 37.08,30.23 36.58,30.73 DBG1.SWDIO
N$45
  Top 0.254: 38.1,28.7 37.08,28.7 34.8,30.99 34.8,33.02 35.05,33.27 DBG1.SWDCLK
  Top 0.305: 38.1,28.7 40.64,26.16 40.64,23.65 39.26,22.27 39.26,21.7 39.37,21.59 41.47,21.59 U2.31
N$46  (via drill 0.6)
  Top 0.305: U2.19 35.38,11.87 v36.58,10.67 | v40.64,10.67 40.89,10.67 SPI1.1
  Bottom 0.305: v36.58,10.67 v40.64,10.67
N$47
  Top 0.305: U2.24 39.38,9.9 41.4,7.87 41.4,7.62 SPI1.2
N$48
  Top 0.305: SPI1.3 39.12,9.14 38.61,9.65 38.61,14.6 U2.23
N$49
  Top 0.305: U2.17 33.78,7.63 SPI1.5
N$51
  Top 0.305: U2.18 34.58,10.89 35.81,9.65 36.32,9.65 36.58,9.4 SPI1.4
N$53
  Top 0.61: S1.INPUT2 S1.INPUT1
  Top 1.016: F1.2 44.96,47.24 S1.INPUT1
PA02-V+SENSE  (via drill 0.6)
  Top 0.254: v44.7,24.64 44.7,25.15 45.72,26.16 49.02,26.16 49.4,25.78
  Top 0.305: R9.1 R10.2 58.42,19.14 58.42,20.32 57.4,21.34 53.85,21.34 49.4,25.78 49.28,25.91 | U2.3 37.78,26.09 v38.1,26.67
  Bottom 0.305: v38.1,26.67 41.15,26.42 42.16,24.64 v44.7,24.64
PA04-V-SENSE  (via drill 0.6)
  Top 0.254: 5.84,37.34 5.84,30.99 | U9.1 10.29,30.35 v10.67,30.18 | v10.92,28.19 10.92,27.94 11.94,26.92 16.26,26.92 17.53,25.65 30.99,25.65 35.05,28.7 36.32,28.7 36.32,24.63 U2.5
  Top 0.305: R19.1 6.69,38.19 5.84,37.34 | 5.84,30.99 6.35,30.48 8.57,30.48 U9.1
  Bottom 0.254: v10.67,30.18 10.67,28.65 v10.92,28.19
PA05-I+  (via drill 0.6)
  Top 0.305: U2.6 35.38,26.74 v35.31,27.18 | U5.7 60.13,13.72 58.93,13.72 58.67,13.97 58.67,15.24 59.69,16.26 59.69,20.07 57.66,22.1 54.1,22.1 49.53,26.67 44.96,26.67 44.45,26.16 v43.43,26.16
  Bottom 0.305: v35.31,27.18 36.83,27.94 41.91,27.94 v43.43,26.16
PA06-I-  (via drill 0.6)
  Top 0.254: U6.7 15.62,25.02 v16.76,23.88 | v21.59,23.88 30.83,23.99 33.78,26.67 34.29,26.67 34.54,26.42 34.54,24.52 U2.7
  Bottom 0.254: v16.76,23.88 v21.59,23.88
PA11-FAULT1
  Top 0.305: U1.FAULT 61.86,45.07 62.23,44.7 62.99,44.7 62.99,44 R3.2
PA19-FAULT2
  Top 0.305: U7.FAULT 18.66,45.09 19.56,44.2 19.56,43.94 21.34,42.16 21.34,40.13 22.1,39.37 26.99,39.37 R6.2
  Top 0.61: 26.98,39.12 R6.2
SHDN  (via drill 0.6)
  Top 0.254: U7.SHDN 7.49,45.09 v7.11,45.47 | v7.11,42.67 7.62,42.67 8.89,41.4 8.89,40.89 16.51,33.27 17.14,32.9 22.21,32.9 25.58,36.26 30.68,36.26 | U1.SHDN 48.28,45.06 47.74,45.03 47.48,45.03 44.8,45.02 42.42,43.69 37.8,40.78 37.59,39.12 37.08,38.61 v36.83,38.61 | 30.68,36.26 v33.02,38.35 | U$1.3 42.01,10.82 40.64,12.19 40.64,12.95 v40.39,13.21 | v37.59,21.59 35.5,21.59 34.33,22.77 33.43,22.77 32.95,23.25 | 32.95,23.25 | 32.95,23.25 v32.22,23.97 | v33.02,29.46 33.02,30.81 31.69,32.13 31.69,35.25 30.68,36.26
  Top 0.305: U$1.3 44.55,10.82 45.21,10.16 46.06,10.16 R23.1
  Bottom 0.254: v7.11,45.47 6.6,45.47 6.35,45.21 6.35,43.43 v7.11,42.67 | v33.02,38.35 36.58,38.35 v36.83,38.61 | v40.39,13.21 40.39,15.49 38.61,17.27 38.61,20.57 v37.59,21.59 | v32.22,23.97 32.22,27.56 33.14,28.48 33.14,29.34 v33.02,29.46
SHDN_SIG
  Top 0.305: U$1.1 44.45,15.49 43.94,15.75 40.39,15.75 39.62,16.51 38.1,16.51 37.85,16.26 37.85,14.7 U2.22
SYNC  (via drill 0.6)
  Top 0.254: 44.55,45.55 41.83,43.91 37.08,41.15 36.88,39.94 33.85,37.05 33.85,37.02 33.85,35.31 34.01,28.82 32,27.18 28.45,27.18 27.69,27.69 27.69,30.73 27.43,31.12 25.65,31.12 24.87,30.25 16.51,30.23 14.93,31.86 13.68,31.86 12.79,32.81 12.79,35.82 v10.92,37.59 | v10.92,40.39 10.92,41.66 12.19,42.93 12.19,43.57 U7.SYNC
  Top 0.305: U1.CLKOUT 44.55,45.55
  Bottom 0.254: v10.92,37.59 v10.92,40.39
VIN+  (via drill 0.6, 0.6 pad 0.81)
  Top 0.305: U1.VIN 62.86,45.57 R3.1
  Top 0.406: U3.1 15.04,15.49 13.46,15.49 12.45,14.48 12.45,13.46 12.95,12.95 13.46,12.95 13.97,12.7 13.97,10.16 14.73,9.65 15.41,9.65 R7.1 15.58,9.65 16.08,9.65 16.24,9.92 16.24,11.63 17.21,11.62 C5.1 18.61,11.62 v23.37,6.86 | 56.68,31.75 56.39,31.75 54.86,31.75 53.59,30.73 v53.59,28.19 | v52.32,21.59 52.32,16 51.31,14.99 | v50.04,13.97 51.05,14.73 51.31,14.99 | v47.75,11.94 46.32,11.94 R23.2 | v24.38,3.56 v33.02,3.56 | v36.58,4.83 50.55,4.83 51.31,5.59 51.31,14.99 | R3.1 63.02,45.47 64.52,45.47 65.28,44.7 65.28,37.34 65.02,37.08 54.21,37.08 53.95,36.83
  Top 0.61: v51.82,41.4 51.82,39.62 52.58,38.86 53.95,38.86 C6.1
  Top 0.813: 54.1,39.01 C6.1 | 56.68,31.75 L1.L1A | 53.95,38.86 53.95,36.83 53.95,36.22 56.39,33.78 56.39,31.75
  Top 1.016: S1.O3 S1.O4 v50.55,48.77
  Bottom 0.406: v53.59,28.19 53.59,24.13 v52.32,21.59 | v50.04,13.97 v47.75,11.94 | v23.37,6.86 23.37,4.57 v24.38,3.56 | v33.02,3.56 34.29,4.83 v36.58,4.83
  Bottom 1.016: v50.55,48.77 50.55,43.18 v51.82,41.4
VIN-  (via drill 0.6 pad 0.81)
  Top 0.305: U7.VIN 19.18,45.59 20.07,44.7 20.07,44.2 21.84,42.42 21.84,40.39 22.11,40.23 28.43,40.24 28.7,39.88 28.7,39.36 R6.1
  Top 0.61: R6.1 28.81,37.73 C10.1
  Top 1.016: v41.4,49.28 38.1,45.97 35.56,45.97 | v46.48,49.28 S1.O1 | C10.1 30.23,37.43 32.51,39.62 35.05,39.62 36.07,40.64 36.07,43.18 35.56,43.69 35.56,45.97 | 35.56,45.97 34.45,45.97 L2.L1A
  Bottom 1.016: v41.4,49.28 v46.48,49.28

### Text on the board
tPlace: V- | V+ | GND